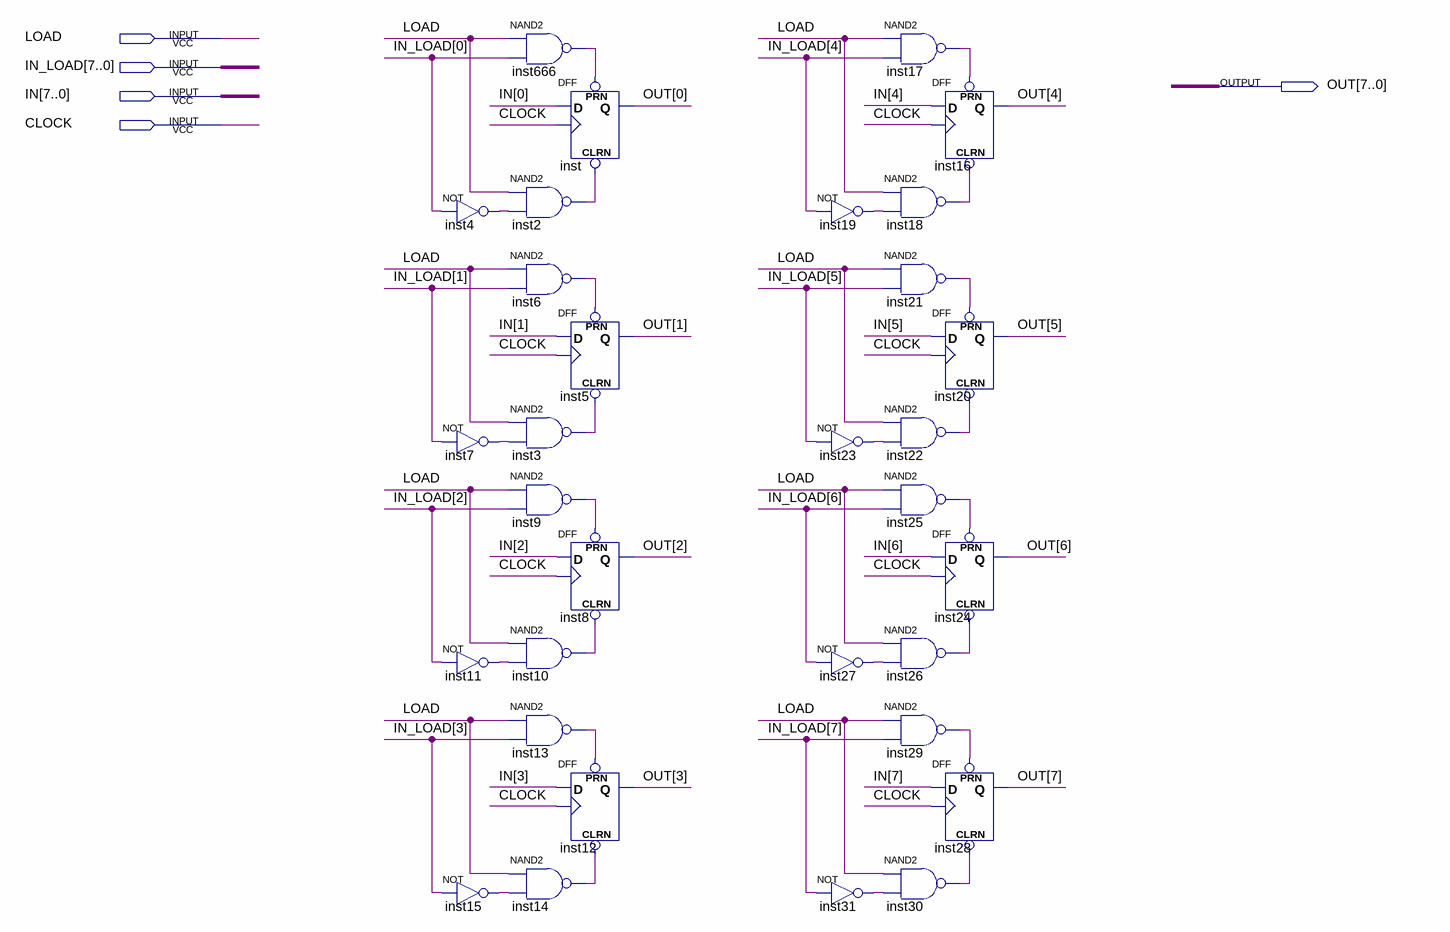
[diagram p0: schematic sheet]
// Quartus schematic REGISTER_8BITS.bdf as structural Verilog: 32 symbols, 5 pins
module REGISTER_8BITS (
  input  LOAD,
  input  [7:0] IN_LOAD,
  input  [7:0] IN,
  input  CLOCK,
  output [7:0] OUT
);

  wire inst2_out, inst3_out, inst4_out, inst6_out, inst7_out, inst9_out, inst10_out, inst11_out, inst13_out,
       inst14_out, inst15_out, inst17_out, inst18_out, inst19_out, inst21_out, inst22_out, inst23_out,
       inst25_out, inst26_out, inst27_out, inst29_out, inst30_out, inst31_out, inst666_out;

  not inst4 (inst4_out, IN_LOAD[0]);
  not inst7 (inst7_out, IN_LOAD[1]);
  not inst11 (inst11_out, IN_LOAD[2]);
  not inst15 (inst15_out, IN_LOAD[3]);
  nand inst666 (inst666_out, LOAD, IN_LOAD[0]);
  nand inst2 (inst2_out, LOAD, inst4_out);
  nand inst6 (inst6_out, LOAD, IN_LOAD[1]);
  nand inst3 (inst3_out, LOAD, inst7_out);
  nand inst9 (inst9_out, LOAD, IN_LOAD[2]);
  nand inst10 (inst10_out, LOAD, inst11_out);
  nand inst13 (inst13_out, LOAD, IN_LOAD[3]);
  nand inst14 (inst14_out, LOAD, inst15_out);
  DFF inst (.CLRN(inst2_out), .CLK(CLOCK), .D(IN[0]), .PRN(inst666_out), .Q(OUT[0]));
  DFF inst5 (.CLRN(inst3_out), .CLK(CLOCK), .D(IN[1]), .PRN(inst6_out), .Q(OUT[1]));
  DFF inst8 (.CLRN(inst10_out), .CLK(CLOCK), .D(IN[2]), .PRN(inst9_out), .Q(OUT[2]));
  DFF inst12 (.CLRN(inst14_out), .CLK(CLOCK), .D(IN[3]), .PRN(inst13_out), .Q(OUT[3]));
  not inst19 (inst19_out, IN_LOAD[4]);
  not inst23 (inst23_out, IN_LOAD[5]);
  not inst27 (inst27_out, IN_LOAD[6]);
  not inst31 (inst31_out, IN_LOAD[7]);
  nand inst17 (inst17_out, LOAD, IN_LOAD[4]);
  nand inst18 (inst18_out, LOAD, inst19_out);
  nand inst21 (inst21_out, LOAD, IN_LOAD[5]);
  nand inst22 (inst22_out, LOAD, inst23_out);
  nand inst25 (inst25_out, LOAD, IN_LOAD[6]);
  nand inst26 (inst26_out, LOAD, inst27_out);
  nand inst29 (inst29_out, LOAD, IN_LOAD[7]);
  nand inst30 (inst30_out, LOAD, inst31_out);
  DFF inst16 (.CLRN(inst18_out), .CLK(CLOCK), .D(IN[4]), .PRN(inst17_out), .Q(OUT[4]));
  DFF inst20 (.CLRN(inst22_out), .CLK(CLOCK), .D(IN[5]), .PRN(inst21_out), .Q(OUT[5]));
  DFF inst24 (.CLRN(inst26_out), .CLK(CLOCK), .D(IN[6]), .PRN(inst25_out), .Q(OUT[6]));
  DFF inst28 (.CLRN(inst30_out), .CLK(CLOCK), .D(IN[7]), .PRN(inst29_out), .Q(OUT[7]));
endmodule
